# Altium schematic sheet Temperature Sensing 8S V0.1.SchDoc
size A4; SheetNumber: 6; SheetTotal: 9
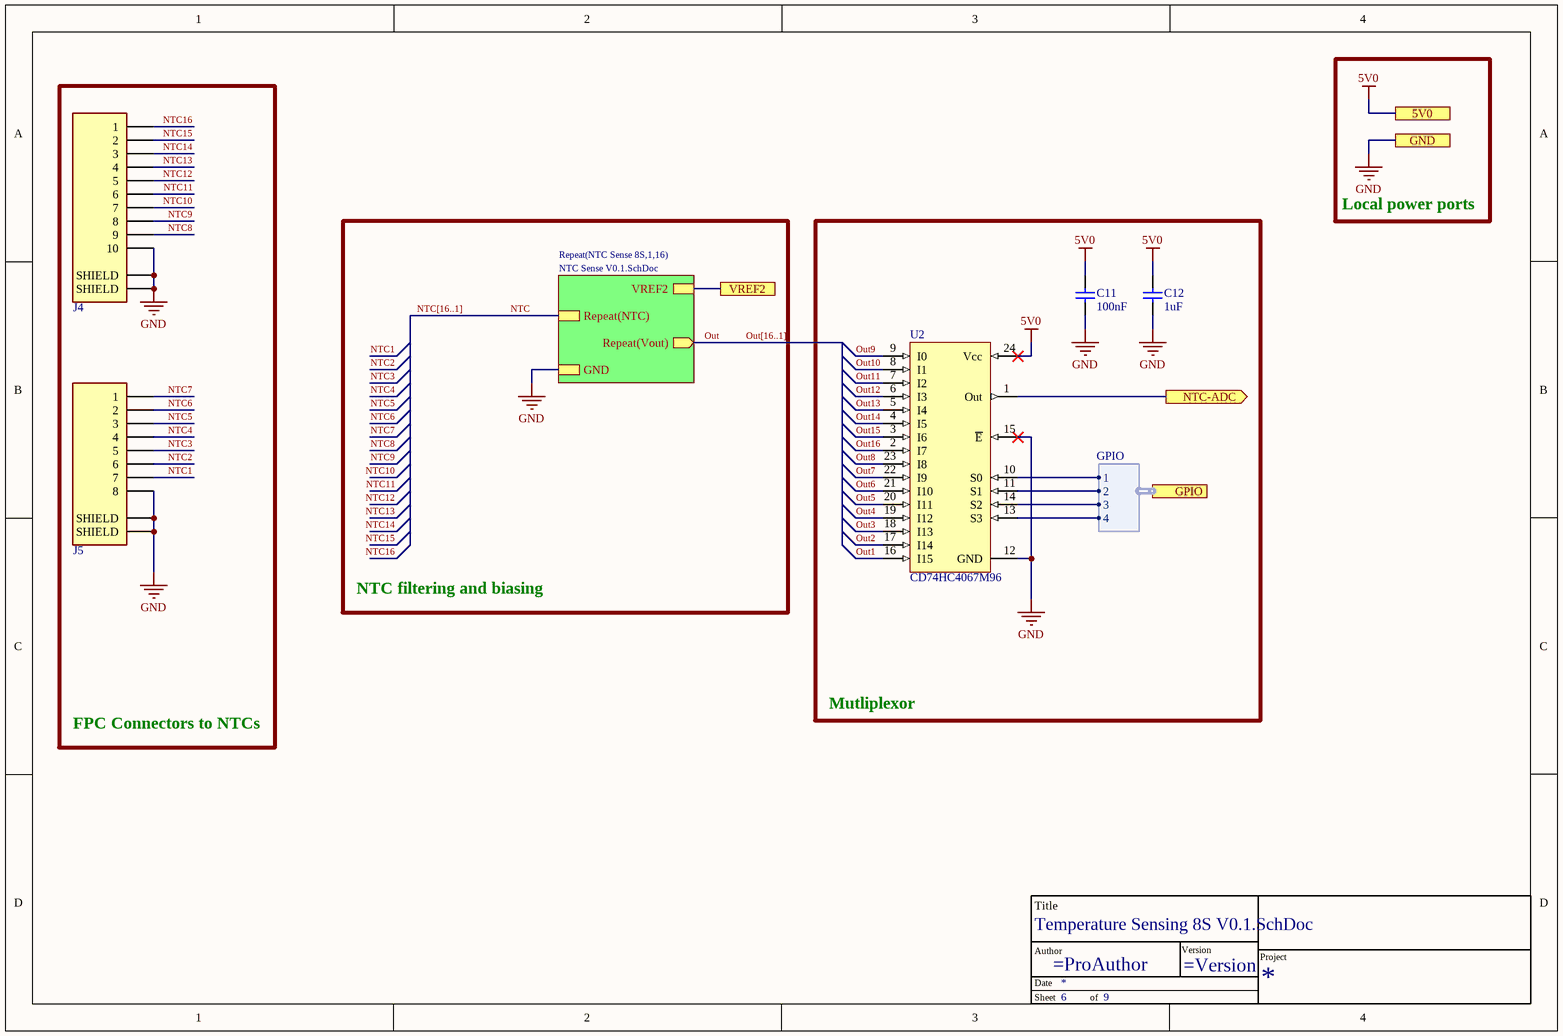
[diagram p0: Temperature Sensing 8S V0.1.SchDoc]

## Parts
*?  TitleBlock  (value not drawn)  (graphical)
C11  value 100nF  [C_0402]  (hidden comment: GRM155R62A104KE14D)
C12  value 1uF  [C_0402]  (hidden comment: EMK105BJ105KV-F)
J4  1-84953-0  [1-84953-0]  (value not drawn)
J5  84953-8  [84953-8]  (value not drawn)
U2  CD74HC4067M96  [SOIC127P1030X265-24N]

## Blocks framed on the sheet
FPC Connectors to NTCs: J4 J5
Mutliplexor: C11 C12 U2

## Sub-sheets
Repeat(NTC Sense 8S,1,16) = NTC Sense V0.1.SchDoc: VREF2, Repeat(Vout) (out), Repeat(NTC), GND

## Ports
5V0, GND, GPIO (harness GPIO), NTC-ADC (out), VREF2

## Harnesses
GPIO: 4, 3, 2, 1

## Nets
5V0: C11.1 C12.2 U2.24(Vcc) ; port 5V0
GND: C11.2 C12.1 J4.10 J4.S1(SHIELD) J4.S2(SHIELD) J5.8 J5.S1(SHIELD) J5.S2(SHIELD) U2.12(GND) U2.15(~{E}) ; port GND, sheet Repeat(NTC Sense 8S,1,16)/GND
NTC: sheet Repeat(NTC Sense 8S,1,16)/Repeat(NTC)
NTC1: J5.7
NTC2: J5.6
NTC3: J5.5
NTC4: J5.4
NTC5: J5.3
NTC6: J5.2
NTC7: J5.1
NTC8: J4.9
NTC9: J4.8
NTC10: J4.7
NTC11: J4.6
NTC12: J4.5
NTC13: J4.4
NTC14: J4.3
NTC15: J4.2
NTC16: J4.1
NTC-ADC: U2.1(Out) ; port NTC-ADC
Out: sheet Repeat(NTC Sense 8S,1,16)/Repeat(Vout)
Out1: U2.16(I15)
Out2: U2.17(I14)
Out3: U2.18(I13)
Out4: U2.19(I12)
Out5: U2.20(I11)
Out6: U2.21(I10)
Out7: U2.22(I9)
Out8: U2.23(I8)
Out9: U2.9(I0)
Out10: U2.8(I1)
Out11: U2.7(I2)
Out12: U2.6(I3)
Out13: U2.5(I4)
Out14: U2.4(I5)
Out15: U2.3(I6)
Out16: U2.2(I7)
VREF2: port VREF2, sheet Repeat(NTC Sense 8S,1,16)/VREF2
NetU2_10: U2.10(S0) ; port GPIO.1
NetU2_11: U2.11(S1) ; port GPIO.2
NetU2_13: U2.13(S3) ; port GPIO.4
NetU2_14: U2.14(S2) ; port GPIO.3

## Buses and harness runs
bus NTC[16..1]
bus Out[16..1]

## Notes on the sheet
- Local power ports
- NTC filtering and biasing
- (in symbol TitleBlock) Title; Author; Version; Project; Date; Sheet; of

## Library data of the parts
C11 C12 = Capacitor: ComponentLink1Description: New link; ComponentLink1URL: *
  C11: Manufacture Part Number 1: GRM155R62A104KE14D
J4 = 1-84953-0: FPC Connectors, Flex-to-Board, 10 Position, .039 in [1 mm] Centerline, Zero Insertion Force (ZIF), Right Angle, Surface Mount
J5 = 84953-8: FPC Connectors, Flex-to-Board, 8 Position, .039 in [1 mm] Centerline, Zero Insertion Force (ZIF), Right Angle, Surface Mount; Manufacturer: TE Connectivity; Body Plating: Tin; Voltage Rating: 200V; Number of Contacts: 8; Current Rating: 1A; Gender: Female; Connector Type: Receptacle,Connector,Socket; Shielding: Unshielded; Wire/Cable Type: Flat Flex; Mating Alignment: Yes (With); PCB Mount Alignment: No (Without); PCB Mount Retention: With; Contact Location: Top; Pitch: 0.039inch; Plating Thickness: 2um; Supplier 1: RSComponents; Manufacturer Part Number: 84953-8; RoHS: Yes; Category: FFC / FPC; Stock 1: 1; Pricing 1: 10=0.83500, 200=0.65000, 750=0.58600, 3000=0.55400, 6000=0.54000 (USD); Mount: Surface Mount; Contact Material: Bronze; Contact Plating: Tin,Bright; Housing Material: Polymer; Housing Color: Natural; Color: Natural; Material: Thermoplastic; Min Operating Temperature: -40°C; Max Operating Temperature: 85°C; Termination: SMD/SMT; Package Quantity: 1500; Packaging: Tape and Reel; Number of Rows: 1; Orientation: Right Angle; Contact Current Rating: 1A; Connector System: Flex-to-Board; Number of Positions: 8; PCB Mounting Orientation: Right Angle; Sealable: No (Without); Shrouded: Yes (With); Length: 0.6268inch; Width: 0.2575inch; Height: 2.56mm; Depth: 2.56mm; Lead Pitch: 1mm; Radiation Hardening: No; REACH SVHC: No SVHC; Flammability Rating: UL94 V-0; ComponentLink1URL: https://datasheet.ciiva.com/11745/0900766b806b36e9-11745458.pdf?src-supplier=RSComponents; ComponentLink1Description: https://datasheet.ciiva.com/11745/0900766b806b36e9-11745458.pdf?src-supplier=RSComponents; ComponentLink2URL: https://datasheet.ciiva.com/669/eng-cd-84953-a3-669123.pdf?src-supplier=Digi-Key; ComponentLink2Description: https://datasheet.ciiva.com/669/eng-cd-84953-a3-669123.pdf?src-supplier=Digi-Key; ComponentLink3URL: https://datasheet.ciiva.com/669/eng-cd-84953-a3-669124.pdf?src-supplier=Digi-Key; ComponentLink3Description: https://datasheet.ciiva.com/669/eng-cd-84953-a3-669124.pdf?src-supplier=Digi-Key; ComponentLink4URL: https://datasheet.ciiva.com/14483/eng-ds-1-1773440-6-0506-14483319.pdf?src-supplier=Farnell; ComponentLink4Description: https://datasheet.ciiva.com/14483/eng-ds-1-1773440-6-0506-14483319.pdf?src-supplier=Farnell; ComponentLink5URL: https://datasheet.ciiva.com/26825/getdatasheetpartid-473787-26825575.pdf?src-supplier=Verical; ComponentLink5Description: https://datasheet.ciiva.com/26825/getdatasheetpartid-473787-26825575.pdf?src-supplier=Verical; ComponentLink6URL: https://datasheet.ciiva.com/8066/586796-8066664.pdf?src-supplier=Element14; ComponentLink6Description: https://datasheet.ciiva.com/8066/586796-8066664.pdf?src-supplier=Element14; ComponentLink7URL: https://datasheet.ciiva.com/669/eng-cd-84953-a3-669122.pdf?src-supplier=Digi-Key; ComponentLink7Description: https://datasheet.ciiva.com/669/eng-cd-84953-a3-669122.pdf?src-supplier=Digi-Key; ComponentLink8URL: https://datasheet.ciiva.com/16658/eng-ds-1-1773440-6-0506-16658613.pdf?src-supplier=Avnet+Europe; ComponentLink8Description: https://datasheet.ciiva.com/16658/eng-ds-1-1773440-6-0506-16658613.pdf?src-supplier=Avnet+Europe; ComponentLink9URL: https://datasheet.ciiva.com/8066/586796-8066666.pdf?src-supplier=Element14; ComponentLink9Description: https://datasheet.ciiva.com/8066/586796-8066666.pdf?src-supplier=Element14; ComponentLink10URL: https://datasheet.ciiva.com/30100/eng-ds-1-1773440-6-0506-30100492.pdf?src-supplier=Onlinecomponents.com; ComponentLink10Description: https://datasheet.ciiva.com/30100/eng-ds-1-1773440-6-0506-30100492.pdf?src-supplier=Onlinecomponents.com; ComponentLink11URL: https://datasheet.ciiva.com/10034/eng-ds-1-1773440-6-0506-10034351.pdf?src-supplier=Avnet; ComponentLink11Description: https://datasheet.ciiva.com/10034/eng-ds-1-1773440-6-0506-10034351.pdf?src-supplier=Avnet; Supplier Part Number 1: 5351707P
U2 = CD74HC4067M96: High-Speed CMOS Logic / 16-Channel Analog Multiplexer/Demultiplexer